# EAGLE design piezo-preamp-tickler_V0-8 (EAGLE 7.7.0)
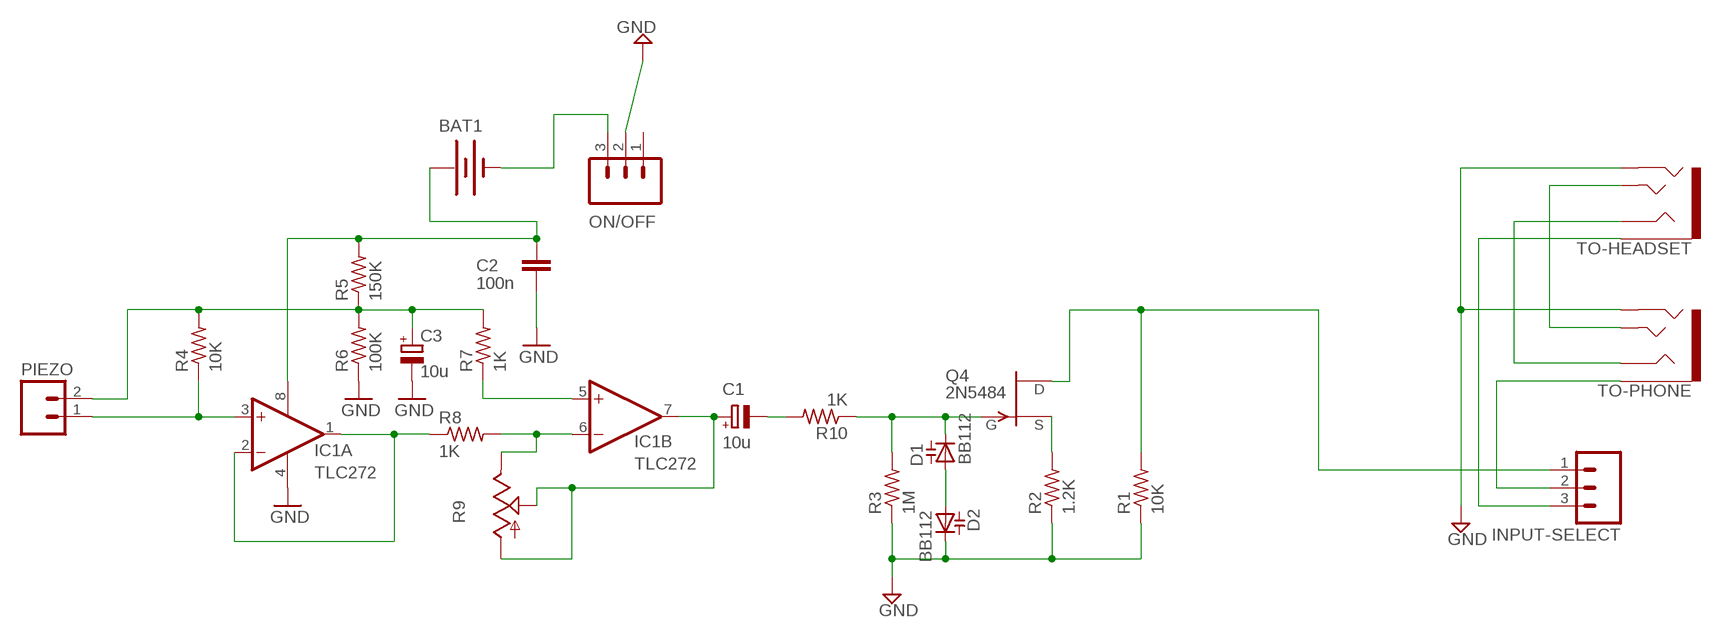
[diagram p0: schematic, sheet 1]

## Parts
BAT1  BATTERYA23  [BATTERY-A23]
C1  10u  CPOL-EUE2.5-5  [E2,5-5]
C2  100n  C-EU025-025X050  [C025-025X050]
C3  10u  CPOL-EUE2.5-5  [E2,5-5]
D1  BB112  [SOT54H]
D2  BB112  [SOT54H]
IC1  TLC272  TLC272P  [DIL08]
INPUT-SELECT  M03SINGLE-POLE-DOUBLE-THROW  [SPDT-SWITCH]
ON/OFF  labl  M03SINGLE-POLE-DOUBLE-THROW  [SPDT-SWITCH]
PIEZO  M02LOCK  [1X02_LOCK]
Q4  2N5484  [TO92-]
R1  10K  R-US_0204/2V  [0204V]
R2  1.2K  R-US_0204/2V  [0204V]
R3  1M  R-US_0204/2V  [0204V]
R4  10K  R-US_0204/2V  [0204V]
R5  150K  R-US_0204/2V  [0204V]
R6  100K  R-US_0204/2V  [0204V]
R7  1K  R-US_0204/2V  [0204V]
R8  1K  R-US_0204/2V  [0204V]
R9  TRIM3386  [TRIM-3386]
R10  1K  R-US_0204/2V  [0204V]
TO-HEADSET  AUDIO-JACK3LGPADS  [AUDIO-JACK-TRRS-SMD]
TO-PHONE  AUDIO-JACK3LGPADS  [AUDIO-JACK-TRRS-SMD]

## Nets
`DEL: INPUT-SELECT.1 Q4.3(D) R1.2
GND: C2.1 C3.- D2.C IC1.4(P:V-) ON/OFF.2 R1.1 R2.1 R3.1 R6.1 TO-HEADSET.RING2 TO-PHONE.RING2
N$1: D1.A D2.A
N$2: BAT1.GND@1(-) ON/OFF.3
N$3: Q4.2(S) R2.2
N$5: IC1.5(B:+IN) R7.1
N$6: C1.+ IC1.7(B:OUT) R9.1(A) R9.2(S) R9.4(A) R9.5(S)
N$7: IC1.6(B:-IN) R8.2 R9.3(E) R9.6(E)
N$8: C3.+ PIEZO.2 R4.2 R5.1 R6.2 R7.2
N$9: IC1.3(A:+IN) PIEZO.1 R4.1
N$10: D1.C Q4.1(G) R3.2 R10.1
N$11: C1.- R10.2
N$12: INPUT-SELECT.3 TO-HEADSET.EARTH
N$13: TO-HEADSET.TIP TO-PHONE.TIP
N$14: IC1.1(A:OUT) IC1.2(A:-IN) R8.1
N$15: TO-HEADSET.RING1 TO-PHONE.RING1
TO-PHONE: INPUT-SELECT.2 TO-PHONE.EARTH
V9V: BAT1.PWR@1(+) C2.2 IC1.8(P:V+) R5.2
Unconnected: ON/OFF.1

## Library data of the parts
BAT1 = Daniel:BATTERY: Battery Holders Various common sizes : AA, AAA, 18650 (PRT-12895), 20mm coin cell and 12mm coin cell. 20MM_4LEGS, BATT-10373
C1 C3 = rcl:CPOL-EU: POLARIZED CAPACITOR, European symbol
C2 = rcl:C-EU: CAPACITOR, European symbol
D1 D2 = diode:BB112: Capacity DIODE variable-capacitance diode
IC1 = linear:TLC272: OP AMP
INPUT-SELECT ON/OFF = Daniel:M03: Single Pole Double Throw Switch 2.0mm pitch 3-pin header for switch.
PIEZO = SparkFun-Connectors:M02: Header 2 Standard 2-pin 0.1" header. Use with straight break away headers (SKU : PRT-00116), right angle break away headers (PRT-00553), swiss pins (PRT-00743), machine pins (PRT-00117), and female headers (PRT-00115). Molex polarized connector foot print use with SKU : PRT-08233 with associated crimp pins and housings.
Q4 = transistor-fet:?548*: N-Channel JFETs Source: VISHAY 2N5484.pdf Compatible: TO92 2N5245 J304 J305 U310 J308 J309 J310 TO72 2N4416 2N4416A 2N3823 2N4351 3N169 3N170 3N171 MFE3002 TO18 2N3796 2N3797 MFE825 Source: Motorola European Master Guide Pacge 3-59
R1-R8 R10 = resistor:R-US_: RESISTOR, American symbol
R9 = Daniel:TRIM
TO-HEADSET TO-PHONE = Daniel:AUDIO-JACK3: Audio jack - 3.5mm TRRS variety - two rings.

## Net classes
0 default: width 0.152 mm, clearance 0.2 mm

## Board
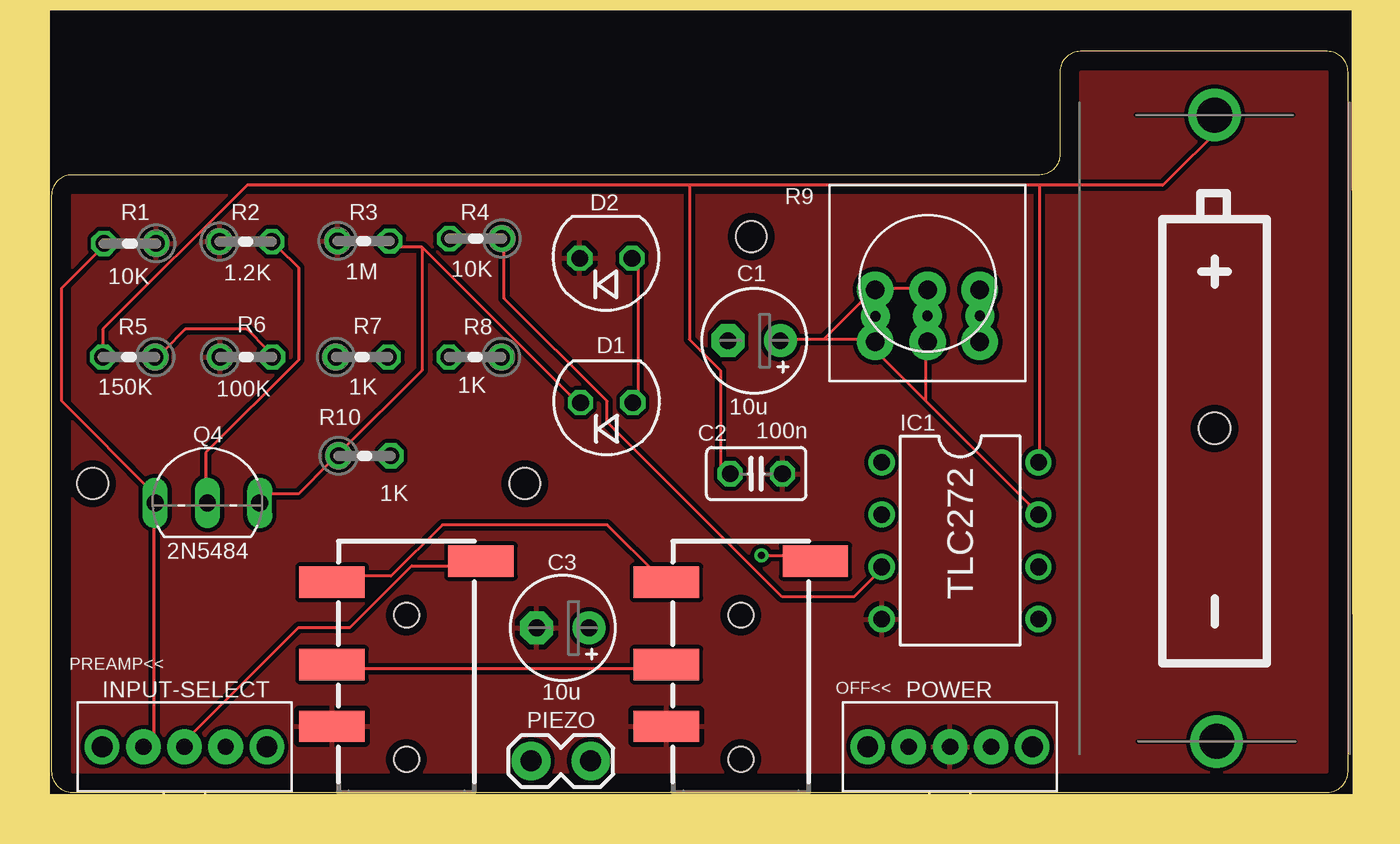
[diagram p1: board, top side]
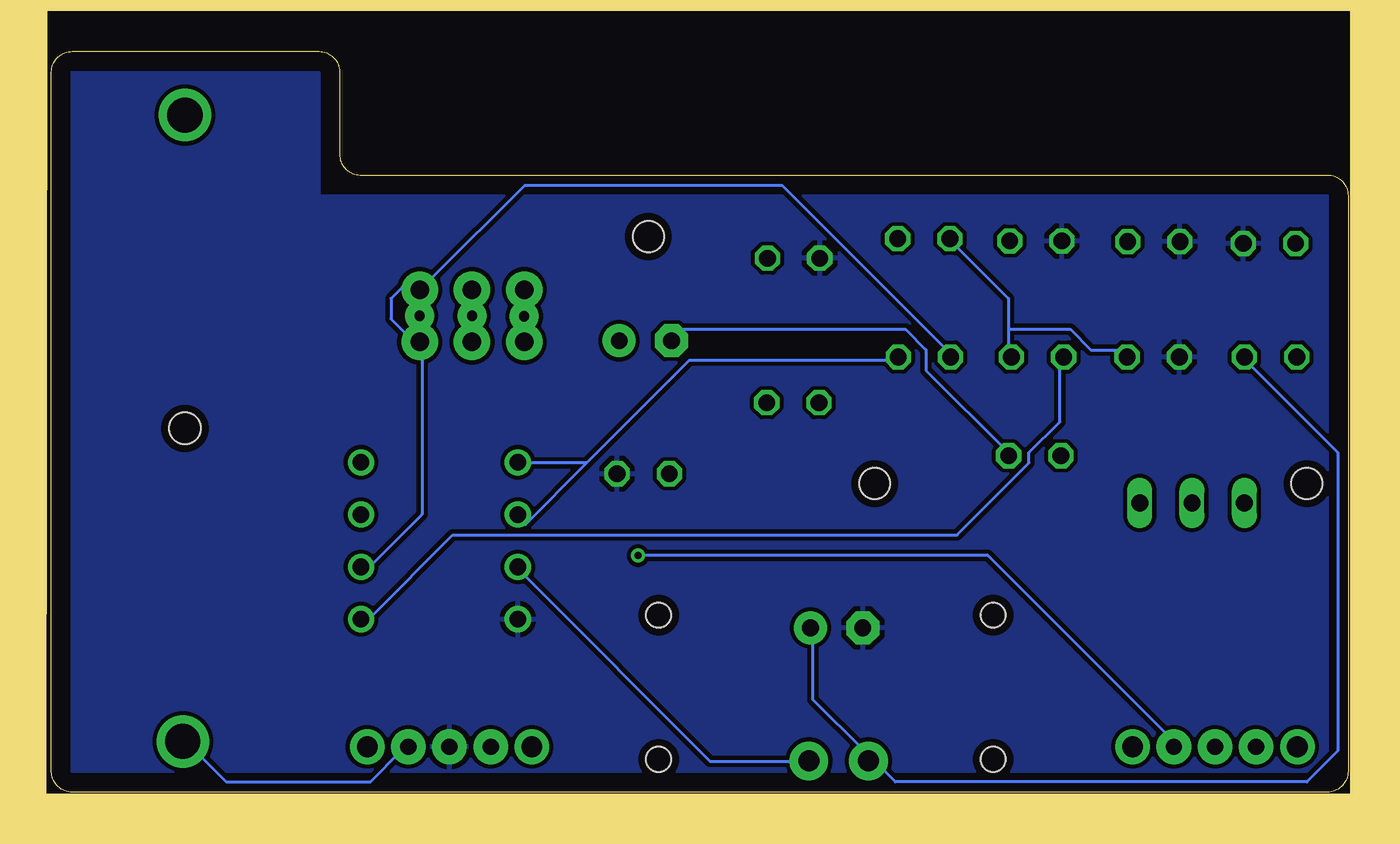
[diagram p2: board, bottom side, seen from below]

Size 63 x 36 mm. Coordinates in mm from the lower left corner, seen from the top.
Outline: 48,30 1,30 arc90 0,29 0,1 arc90 1,0 62,0 arc90 63,1 63,35 arc90 62,36 50,36 arc90 49,35 49,31 arc-90 48,30
Copper layers (1*16): Top 0.0356mm / dielectric 1.5011mm / Bottom 0.0356mm
Design rules "oshpark-2layer": minimum track width 6mil, minimum drill 13mil, track to track 6mil, track to pad 6mil, pad to pad 6mil, via to via 6mil, smd to smd 6mil, copper to edge 15mil, drill to drill 6mil, minimum pad ring 7mil, minimum via ring 7mil, stop-mask expansion 2.5mil, vias tented up to drill 0mil, thermal gap 10mil
Holes 1.5 mm at 34,27 2,15 23,15
Milling: 4 lines

### Footprints (pad centres in the part's own frame; a part is rotated, then mirrored left to right if it is on the bottom)
BATTERY-A23 = drill 1.702: GND@1 15.22,0.1; PWR@1 -15.22,0 | hole 1.524: 0,0
E2,5-5 = drill 0.813 pad 1.6: + -1.27,0 | drill 0.813 pad 1.6 octagon: - 1.27,0
C025-025X050 = drill 0.813 octagon: 1 -1.27,0; 2 1.27,0
SOT54H = drill 0.813 octagon: A 1.27,0; C -1.27,0
DIL08 = drill 0.813 pad 1.27: 1 -3.81,-3.81; 2 -1.27,-3.81; 3 1.27,-3.81; 4 3.81,-3.81; 5 3.81,3.81; 6 1.27,3.81; 7 -1.27,3.81; 8 -3.81,3.81
SPDT-SWITCH = drill 0.8 pad 1.676: 1 2,0; 2 4,0; 3 6,0 | drill 1 pad 1.676: P$1 0,0; P$2 8,0
1X02_LOCK = drill 1.016 pad 1.88: 1 -0.178,0; 2 2.718,0
TO92- = drill 0.813 long: 1 2.54,0; 2 0,0; 3 -2.54,0
0204V = drill 0.813 octagon: 1 -1.27,0; 2 1.27,0
TRIM-3386 = drill 0.9 pad 1.778: 1 -2.54,-2.857; 2 0,-2.857; 3 2.54,-2.857; 4 -2.54,-0.318; 5 0,-0.318; 6 2.54,-0.318
AUDIO-JACK-TRRS-SMD = smd 1.524 x 3.175: EARTH 11.227,-3.619; RING1 6.2,3.619; RING2 3.2,3.619; TIP 10.2,3.619 | hole 1.2: 1.6,0; 8.6,0

### Placement (x,y rotation side)
BAT1  56.52,17.68 270 top
C1  34.15,21.94 180 top
C2  34.24,15.47 180 top
C3  24.85,7.98 180 top
D1  26.98,18.93 0 top
D2  26.94,25.95 0 top
IC1  44.15,12.22 270 top
INPUT-SELECT  2.46,2.21 0 top
ON/OFF  39.66,2.21 0 top
PIEZO  26.02,1.51 180 top
Q4  7.58,14.05 0 top
R1  3.81,26.67 180 top
R2  9.44,26.75 0 top
R3  15.17,26.79 0 top
R4  20.61,26.9 180 top
R5  3.77,21.15 180 top
R6  9.46,21.15 0 top
R7  15.09,21.15 0 top
R8  20.59,21.15 180 top
R9  42.56,24.74 0 top
R10  15.22,16.35 0 top
TO-HEADSET  33.5,0 90 top
TO-PHONE  17.25,0 90 top

### Tracks (layer width: path | path; a pad name or v marks a point on that pad's centre or on a via)
`DEL
  Top 0.152: INPUT-SELECT.1 4.5,2 5,2.5 5,14 Q4.3 5,14.5 0.5,19 0.5,24.5 2.5,26.5 R1.2
GND
  pour Bottom: 62,35 50,35 50,29 1,29 1,28 1,1 62,1
  pour Top: 62,1 62,35 50,35 50,29 1,29 1,1
N$1
  Top 0.152: D1.A 28.5,19 28.5,25.5 D2.A
N$2
  Bottom 0.152: ON/OFF.3 46,2 47.5,0.5 54.5,0.5 56.5,2.5 BAT1.GND@1
N$3
  Top 0.152: Q4.2 7.5,14.5 7.5,16.5 12,21 12,25.5 11,26.5 R2.2
N$5
  Bottom 0.152: R7.1 14,21 14,18 15.5,16.5 15.5,16 19,12.5 43.5,12.5 47.5,8.5 IC1.5
N$6
  Top 0.152: 42.5,19 40,21.5 R9.1 40,22 37.5,22 | 42.5,19 47.5,14 47.5,13.5 IC1.7 | 37.5,22 35.5,22 C1.+ | 42.5,19 42.5,21.5 R9.2 | 37.5,22 40,24.5 R9.4 40.5,24.5 42.5,24.5 R9.5
N$7
  Bottom 0.152: IC1.6 47.5,11 45,13.5 45,21.5 R9.3 45.5,22 46.5,23 46.5,24 45.5,25 44.5,25 | 44.5,25 45,24.5 R9.6 44.5,25 | 44.5,25 40,29.5 27.5,29.5 19.5,21.5 R8.2
N$8
  Top 0.152: R5.1 5.5,21.5 6.5,22.5 9.5,22.5 10.5,21.5 R6.2
  Bottom 0.152: C3.+ 26,7.5 26,4.5 23.5,2 PIEZO.2 23,1.5 22,0.5 2,0.5 0.5,2 0.5,16.5 5,21 R5.1 | 16.5,22.5 16.5,24 19,26.5 R4.2 | 16.5,22.5 16.5,21.5 R7.2 | 16.5,22.5 13.5,22.5 12.5,21.5 11,21.5 R6.2
N$9
  Top 0.152: R4.1 22,26.5 22,24 27,19 27,18 35.5,9.5 39,9.5 40,10.5 IC1.3
  Bottom 0.152: PIEZO.1 26.5,1.5 31,1.5 40,10.5 IC1.3
N$10
  Top 0.152: Q4.1 10.5,14.5 12,14.5 13.5,16 R10.1 14,16.5 18,20.5 18,26.5 | 18,26.5 16.5,26.5 R3.2 | 18,26.5 25.5,19 D1.C
N$11
  Bottom 0.152: R10.2 16.5,16.5 20.5,20.5 20.5,21.5 21.5,22.5 32.5,22.5 33,22 C1.-
N$12  (via drill 0.33)
  Top 0.152: v34.5,11.5 37,11.5 TO-HEADSET.EARTH
  Bottom 0.152: v34.5,11.5 17.5,11.5 8.5,2.5 INPUT-SELECT.3
N$13
  Top 0.152: TO-PHONE.TIP 14,10.5 16.5,10.5 19,13 27,13 29.5,10.5 TO-HEADSET.TIP
N$14
  Bottom 0.152: 37,16 40,13 IC1.2 | 37,16 32,21 22,21 R8.1 | 37,16 40,16 IC1.1
N$15
  Top 0.152: TO-PHONE.RING1 14,6 29.5,6 TO-HEADSET.RING1
N$16  (via drill 0.5 pad 1.42)
  other vias: 40.03,23.13
N$17  (via drill 0.5 pad 1.42)
  other vias: 42.56,23.16
N$18  (via drill 0.5 pad 1.42)
  other vias: 45.12,23.16
TO-PHONE
  Top 0.152: TO-PHONE.EARTH 20.5,11 17.5,11 14.5,8 12,8 6.5,2.5 INPUT-SELECT.2
V9V
  Top 0.152: 48,29.5 54,29.5 57,32.5 BAT1.PWR@1 | 48,29.5 31,29.5 | 31,29.5 9.5,29.5 2.5,22.5 2.5,21.5 R5.2 | 31,29.5 31,22 32.5,20.5 32.5,15.5 C2.2 | 48,29.5 48,16.5 IC1.8

### Text on the board
tNames: PREAMP<< | OFF<< | POWER